# EAGLE design multitix-R1 (EAGLE 4.16)
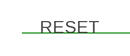
[diagram p0: schematic, sheet 1, part 1 of 2]
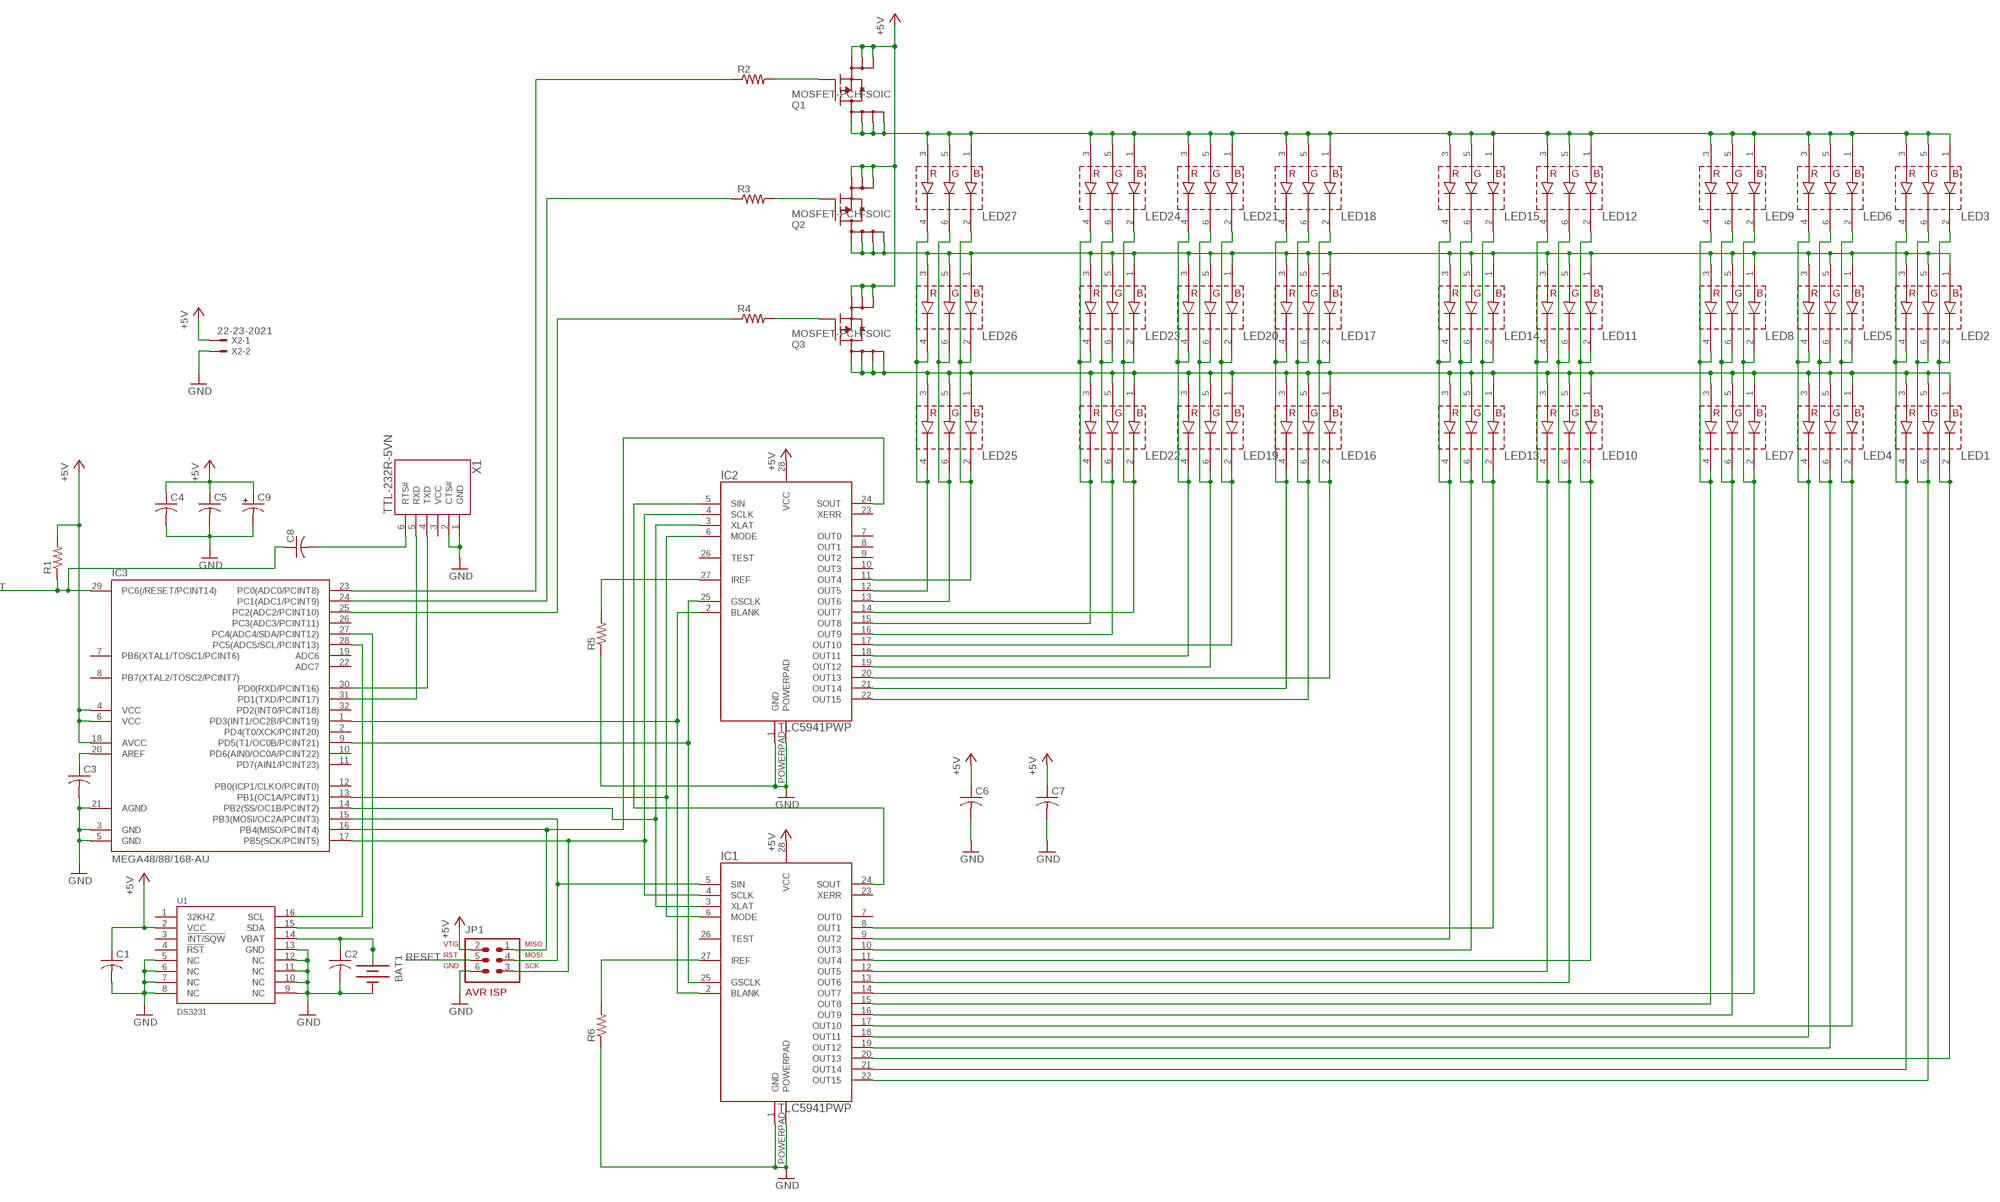
[diagram p1: schematic, sheet 1, part 2 of 2]

## Parts
BAT1  BATTERY12MM  [BATTCON_12MM]
C1  C-USC0805  [C0805]
C2  C-USC0805  [C0805]
C3  C-USC0805  [C0805]
C4  C-USC0805  [C0805]
C5  C-USC0805  [C0805]
C6  C-USC0805  [C0805]
C7  C-USC0805  [C0805]
C8  C-USC0805  [C0805]
C9  CPOL-USB  [PANASONIC_B]
IC1  TLC5941PWP  [POWERPAD-28]
IC2  TLC5941PWP  [POWERPAD-28]
IC3  MEGA48/88/168-AU  [TQFP32-08]
JP1  AVR-ISP-6  [AVR-ISP-6]
LED1  RGB-LED-PLCC6  [PLCC-6]
LED2  RGB-LED-PLCC6  [PLCC-6]
LED3  RGB-LED-PLCC6  [PLCC-6]
LED4  RGB-LED-PLCC6  [PLCC-6]
LED5  RGB-LED-PLCC6  [PLCC-6]
LED6  RGB-LED-PLCC6  [PLCC-6]
LED7  RGB-LED-PLCC6  [PLCC-6]
LED8  RGB-LED-PLCC6  [PLCC-6]
LED9  RGB-LED-PLCC6  [PLCC-6]
LED10  RGB-LED-PLCC6  [PLCC-6]
LED11  RGB-LED-PLCC6  [PLCC-6]
LED12  RGB-LED-PLCC6  [PLCC-6]
LED13  RGB-LED-PLCC6  [PLCC-6]
LED14  RGB-LED-PLCC6  [PLCC-6]
LED15  RGB-LED-PLCC6  [PLCC-6]
LED16  RGB-LED-PLCC6  [PLCC-6]
LED17  RGB-LED-PLCC6  [PLCC-6]
LED18  RGB-LED-PLCC6  [PLCC-6]
LED19  RGB-LED-PLCC6  [PLCC-6]
LED20  RGB-LED-PLCC6  [PLCC-6]
LED21  RGB-LED-PLCC6  [PLCC-6]
LED22  RGB-LED-PLCC6  [PLCC-6]
LED23  RGB-LED-PLCC6  [PLCC-6]
LED24  RGB-LED-PLCC6  [PLCC-6]
LED25  RGB-LED-PLCC6  [PLCC-6]
LED26  RGB-LED-PLCC6  [PLCC-6]
LED27  RGB-LED-PLCC6  [PLCC-6]
Q1  MOSFET-PCH-SOIC  [SOIC127P600X175-8AN]
Q2  MOSFET-PCH-SOIC  [SOIC127P600X175-8AN]
Q3  MOSFET-PCH-SOIC  [SOIC127P600X175-8AN]
R1  R-US_M0805  [M0805]
R2  R-US_M0805  [M0805]
R3  R-US_M0805  [M0805]
R4  R-US_M0805  [M0805]
R5  R-US_M0805  [M0805]
R6  R-US_M0805  [M0805]
U1  DS3231  [SO16W]
X1  TTL-232R-5VN  [USBCABLE-0.100-NOLBL]
X2  22-23-2021  [22-23-2021]

## Nets
+5V: C1.1 C4.1 C5.1 C6.1 C7.1 C9.+ IC1.28(VCC) IC2.28(VCC) IC3.4(VCC) IC3.6(VCC) IC3.18(AVCC) JP1.2 Q1.1(S) Q1.2(S1) Q1.3(S2) Q2.1(S) Q2.2(S1) Q2.3(S2) Q3.1(S) Q3.2(S1) Q3.3(S2) R1.2 U1.2(VCC) X2.1
GND: BAT1.GND(-) C1.2 C2.2 C3.2 C4.2 C5.2 C6.2 C7.2 C9.- IC1.1(GND) IC1.POWERPAD IC2.1(GND) IC2.POWERPAD IC3.3(GND) IC3.5(GND) IC3.21(AGND) JP1.6 R5.1 R6.1 U1.5(NC) U1.6(NC) U1.7(NC) U1.8(NC) U1.9(NC) U1.10(NC) U1.11(NC) U1.12(NC) U1.13(GND) X1.1(GND) X1.2(CTS#) X2.2
N$1: IC1.25(GSCLK) IC2.25(GSCLK) IC3.9(PD5(T1/OC0B/PCINT21))
N$2: IC2.21(OUT14) LED16.4(RK) LED17.4(RK) LED18.4(RK)
N$3: IC1.22(OUT15) LED1.6(GK) LED2.6(GK) LED3.6(GK)
N$4: IC1.20(OUT13) LED1.2(BK) LED2.2(BK) LED3.2(BK)
N$5: IC1.21(OUT14) LED1.4(RK) LED2.4(RK) LED3.4(RK)
N$6: IC1.2(BLANK) IC2.2(BLANK) IC3.1(PD3(INT1/OC2B/PCINT19))
N$7: LED3.1(BA) LED3.3(RA) LED3.5(GA) LED6.1(BA) LED6.3(RA) LED6.5(GA) LED9.1(BA) LED9.3(RA) LED9.5(GA) LED12.1(BA) LED12.3(RA) LED12.5(GA) LED15.1(BA) LED15.3(RA) LED15.5(GA) LED18.1(BA) LED18.3(RA) LED18.5(GA) LED21.1(BA) LED21.3(RA) LED21.5(GA) LED24.1(BA) LED24.3(RA) LED24.5(GA) LED27.1(BA) LED27.3(RA) LED27.5(GA) Q1.5(D) Q1.6(D1) Q1.7(D2) Q1.8(D3)
N$8: IC1.18(OUT11) LED4.4(RK) LED5.4(RK) LED6.4(RK)
N$9: IC1.19(OUT12) LED4.6(GK) LED5.6(GK) LED6.6(GK)
N$10: IC1.17(OUT10) LED4.2(BK) LED5.2(BK) LED6.2(BK)
N$11: IC2.22(OUT15) LED16.6(GK) LED17.6(GK) LED18.6(GK)
N$12: IC2.20(OUT13) LED16.2(BK) LED17.2(BK) LED18.2(BK)
N$13: LED2.1(BA) LED2.3(RA) LED2.5(GA) LED5.1(BA) LED5.3(RA) LED5.5(GA) LED8.1(BA) LED8.3(RA) LED8.5(GA) LED11.1(BA) LED11.3(RA) LED11.5(GA) LED14.1(BA) LED14.3(RA) LED14.5(GA) LED17.1(BA) LED17.3(RA) LED17.5(GA) LED20.1(BA) LED20.3(RA) LED20.5(GA) LED23.1(BA) LED23.3(RA) LED23.5(GA) LED26.1(BA) LED26.3(RA) LED26.5(GA) Q2.5(D) Q2.6(D1) Q2.7(D2) Q2.8(D3)
N$14: IC1.15(OUT8) LED7.4(RK) LED8.4(RK) LED9.4(RK)
N$15: IC1.16(OUT9) LED7.6(GK) LED8.6(GK) LED9.6(GK)
N$16: IC1.14(OUT7) LED7.2(BK) LED8.2(BK) LED9.2(BK)
N$17: IC1.6(MODE) IC2.6(MODE) IC3.13(PB1(OC1A/PCINT1))
N$18: IC2.18(OUT11) LED19.4(RK) LED20.4(RK) LED21.4(RK)
N$19: IC2.19(OUT12) LED19.6(GK) LED20.6(GK) LED21.6(GK)
N$20: IC1.12(OUT5) LED10.4(RK) LED11.4(RK) LED12.4(RK)
N$21: IC1.13(OUT6) LED10.6(GK) LED11.6(GK) LED12.6(GK)
N$22: IC1.11(OUT4) LED10.2(BK) LED11.2(BK) LED12.2(BK)
N$23: IC1.3(XLAT) IC2.3(XLAT) IC3.14(PB2(SS/OC1B/PCINT2))
N$24: IC1.4(SCLK) IC2.4(SCLK) IC3.17(PB5(SCK/PCINT5)) JP1.3
N$25: IC1.9(OUT2) LED13.4(RK) LED14.4(RK) LED15.4(RK)
N$26: IC1.10(OUT3) LED13.6(GK) LED14.6(GK) LED15.6(GK)
N$27: IC1.8(OUT1) LED13.2(BK) LED14.2(BK) LED15.2(BK)
N$28: IC2.17(OUT10) LED19.2(BK) LED20.2(BK) LED21.2(BK)
N$29: IC2.15(OUT8) LED22.4(RK) LED23.4(RK) LED24.4(RK)
N$30: IC2.16(OUT9) LED22.6(GK) LED23.6(GK) LED24.6(GK)
N$31: IC1.24(SOUT) IC2.5(SIN)
N$32: IC2.14(OUT7) LED22.2(BK) LED23.2(BK) LED24.2(BK)
N$33: IC3.30(PD0(RXD/PCINT16)) X1.4(TXD)
N$34: BAT1.PWR@1(+) C2.1 U1.14(VBAT)
N$35: IC1.5(SIN) IC3.15(PB3(MOSI/OC2A/PCINT3)) JP1.4
N$36: IC2.12(OUT5) LED25.4(RK) LED26.4(RK) LED27.4(RK)
N$37: IC2.13(OUT6) LED25.6(GK) LED26.6(GK) LED27.6(GK)
N$38: IC2.11(OUT4) LED25.2(BK) LED26.2(BK) LED27.2(BK)
N$39: LED1.1(BA) LED1.3(RA) LED1.5(GA) LED4.1(BA) LED4.3(RA) LED4.5(GA) LED7.1(BA) LED7.3(RA) LED7.5(GA) LED10.1(BA) LED10.3(RA) LED10.5(GA) LED13.1(BA) LED13.3(RA) LED13.5(GA) LED16.1(BA) LED16.3(RA) LED16.5(GA) LED19.1(BA) LED19.3(RA) LED19.5(GA) LED22.1(BA) LED22.3(RA) LED22.5(GA) LED25.1(BA) LED25.3(RA) LED25.5(GA) Q3.5(D) Q3.6(D1) Q3.7(D2) Q3.8(D3)
N$40: IC2.24(SOUT) IC3.16(PB4(MISO/PCINT4)) JP1.1
N$41: IC3.28(PC5(ADC5/SCL/PCINT13)) U1.16(SCL)
N$42: IC3.27(PC4(ADC4/SDA/PCINT12)) U1.15(SDA)
N$43: C3.1 IC3.20(AREF)
N$44: IC3.31(PD1(TXD/PCINT17)) X1.5(RXD)
N$45: Q3.4(G) R4.2
N$46: Q2.4(G) R3.2
N$47: Q1.4(G) R2.2
N$48: IC1.27(IREF) R6.2
N$49: IC2.27(IREF) R5.2
N$50: C8.2 X1.6(RTS#)
N$51: IC3.23(PC0(ADC0/PCINT8)) R2.1
N$52: IC3.24(PC1(ADC1/PCINT9)) R3.1
N$53: IC3.25(PC2(ADC2/PCINT10)) R4.1
RESET: C8.1 IC3.29(PC6(/RESET/PCINT14)) JP1.5 R1.1
Unconnected: IC1.7(OUT0) IC1.23(XERR) IC1.26(TEST) IC2.7(OUT0) IC2.8(OUT1) IC2.9(OUT2) IC2.10(OUT3) IC2.23(XERR) IC2.26(TEST) IC3.2(PD4(T0/XCK/PCINT20)) IC3.7(PB6(XTAL1/TOSC1/PCINT6)) IC3.8(PB7(XTAL2/TOSC2/PCINT7)) IC3.10(PD6(AIN0/OC0A/PCINT22)) IC3.11(PD7(AIN1/PCINT23)) IC3.12(PB0(ICP1/CLKO/PCINT0)) IC3.19(ADC6) IC3.22(ADC7) IC3.26(PC3(ADC3/PCINT11)) IC3.32(PD2(INT0/PCINT18)) U1.1(32KHZ) U1.3(!INT/SQW) U1.4(!RST) X1.3(VCC)

## Library data of the parts
BAT1 = sfe-sparkfun:BATTERY: Battery Holders Various common sizes : AA, AAA, 20mm coin cell and 12mm coin cell.
C1-C8 = rcl:C-US: CAPACITOR, American symbol
C9 = rcl:CPOL-US: POLARIZED CAPACITOR, American symbol
IC1 IC2 = rbg-ti-ledcontrol:TLC5941
IC3 = avr-5-4.16:MEGA48/88/168
JP1 = avr-5-4.16:AVR-ISP-6: AVR ISP-6 Serial Programming Header
LED1-LED27 = rbg-topbright-rgb-smd-led:RGB-LED-PLCC6
Q1-Q3 = ipc-7351-transistor:MOSFET-PCH-SOIC
R1-R6 = rcl:R-US_: RESISTOR, American symbol
U1 = DS3231:DS3231
X1 = rbg-ftdi-usb:TTL-232R-5V
X2 = con-molex:22-23-2021: .100" (2.54mm) Center Header - 2 Pin

## Board
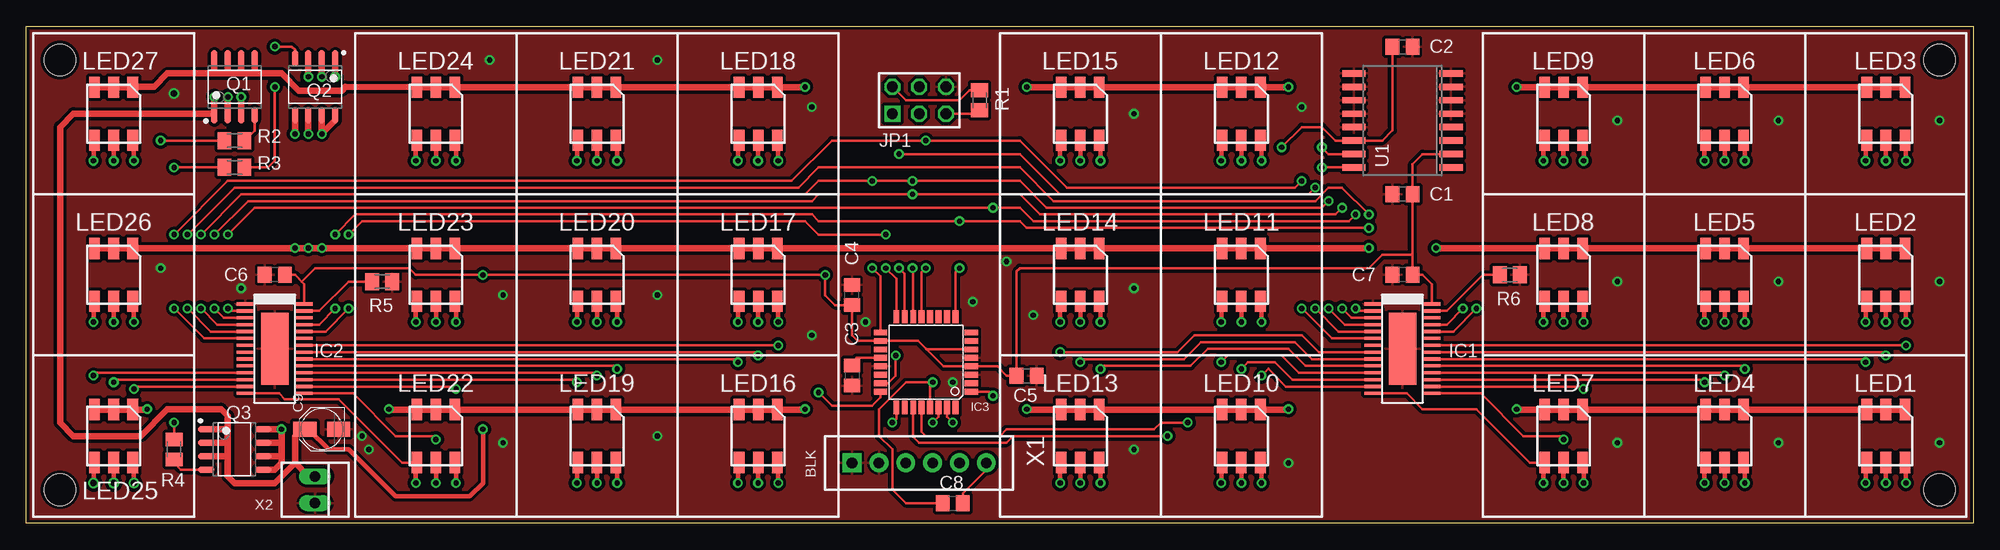
[diagram p2: board, top side]
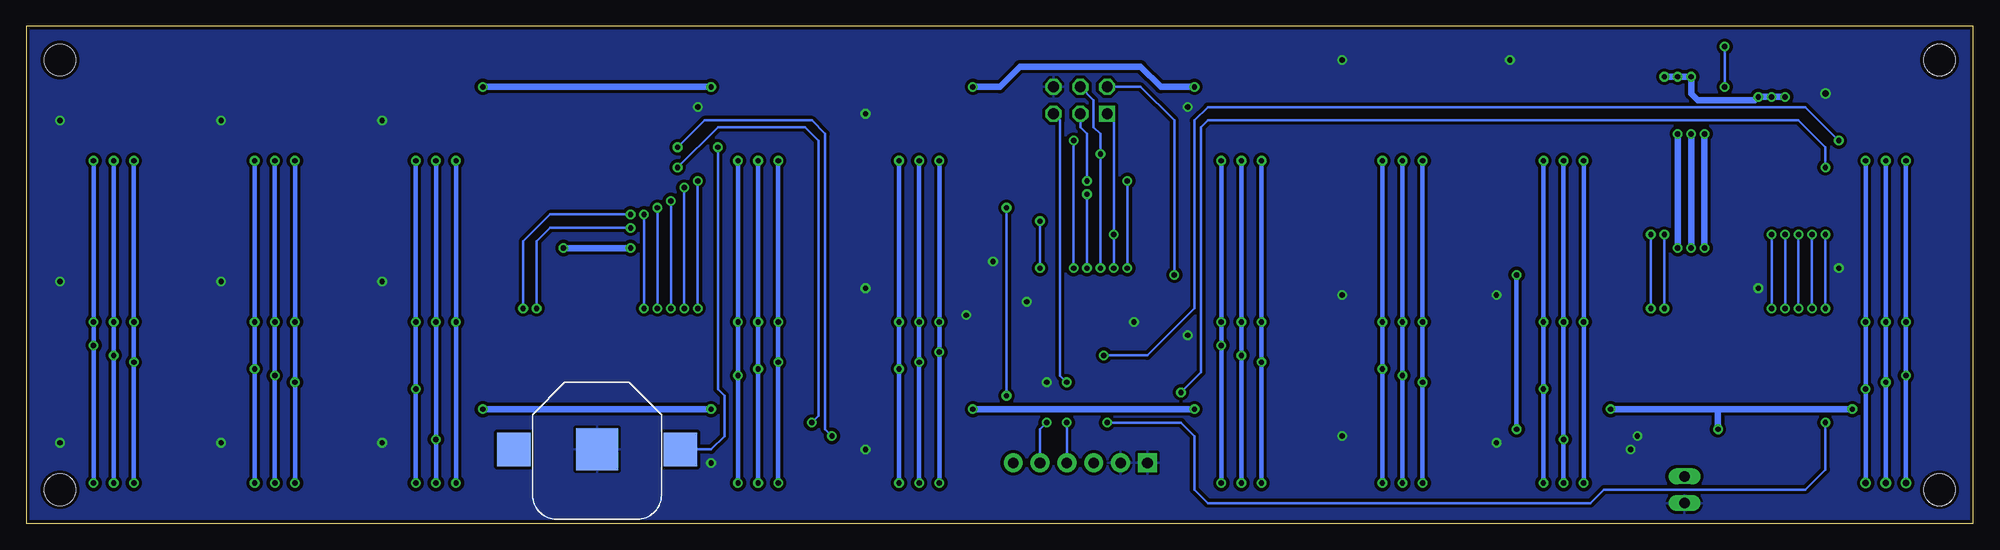
[diagram p3: board, bottom side, seen from below]

Size 184.15 x 46.99 mm. Coordinates in mm from the lower left corner, seen from the top.
Outline: 0,0 0,46.99 184.15,46.99 184.15,0 0,0
Copper layers (1*16): Top 0.035mm / dielectric 1.5mm / Bottom 0.035mm
Design rules "default": minimum track width 10mil, minimum drill 19mil, track to track 8mil, track to pad 8mil, pad to pad 8mil, via to via 8mil, smd to smd 8mil, copper to edge 10mil, drill to drill 8mil, minimum pad ring 10mil, minimum via ring 8mil, stop-mask expansion 4mil, vias tented up to drill 20mil, thermal gap 10mil
Holes 3 mm at 3.17,3.17 3.17,43.81 180.97,43.81 180.97,3.17

### Footprints (pad centres in the part's own frame; a part is rotated, then mirrored left to right if it is on the bottom)
BATTCON_12MM = smd 3.962 x 3.962: GND 0,0 | smd 3.175 x 3.175: PWR@1 -7.874,0; PWR@2 7.874,0
C0805 = smd 1.3 x 1.5: 1 -0.95,0; 2 0.95,0
PANASONIC_B = smd 2.2 x 1.4: + 1.6,0; - -1.6,0
POWERPAD-28 = smd 0.3 x 1.6: 1 -4.225,-2.8; 2 -3.575,-2.8; 3 -2.925,-2.8; 4 -2.275,-2.8; 5 -1.625,-2.8; 6 -0.975,-2.8; 7 -0.325,-2.8; 8 0.325,-2.8; 9 0.975,-2.8; 10 1.625,-2.8; 11 2.275,-2.8; 12 2.925,-2.8; 13 3.575,-2.8; 14 4.225,-2.8; 15 4.225,2.8; 16 3.575,2.8; 17 2.925,2.8; 18 2.275,2.8; 19 1.625,2.8; 20 0.975,2.8; 21 0.325,2.8; 22 -0.325,2.8; 23 -0.975,2.8; 24 -1.625,2.8; 25 -2.275,2.8; 26 -2.925,2.8; 27 -3.575,2.8; 28 -4.225,2.8 | smd 6.8 x 2.6: POWERPAD 0,0
TQFP32-08 = smd 1.27 x 0.559: 1 -4.293,2.8; 2 -4.293,2; 3 -4.293,1.2; 4 -4.293,0.4; 5 -4.293,-0.4; 6 -4.293,-1.2; 7 -4.293,-2; 8 -4.293,-2.8; 17 4.293,-2.8; 18 4.293,-2; 19 4.293,-1.2; 20 4.293,-0.4; 21 4.293,0.4; 22 4.293,1.2; 23 4.293,2; 24 4.293,2.8 | smd 0.559 x 1.27: 9 -2.8,-4.293; 10 -2,-4.293; 11 -1.2,-4.293; 12 -0.4,-4.293; 13 0.4,-4.293; 14 1.2,-4.293; 15 2,-4.293; 16 2.8,-4.293; 25 2.8,4.293; 26 2,4.293; 27 1.2,4.293; 28 0.4,4.293; 29 -0.4,4.293; 30 -1.2,4.293; 31 -2,4.293; 32 -2.8,4.293
AVR-ISP-6 = drill 1.016 square: 1 -2.54,-1.27 | drill 1.016 octagon: 2 -2.54,1.27; 3 0,-1.27; 4 0,1.27; 5 2.54,-1.27; 6 2.54,1.27
PLCC-6 = smd 1 x 2: 1 -1.8,2.5; 2 -1.8,-2.5; 3 0,2.5; 4 0,-2.5; 5 1.8,2.5; 6 1.8,-2.5
SOIC127P600X175-8AN = smd 1.55 x 0.6: 1 -2.7,1.905; 2 -2.7,0.635; 3 -2.7,-0.635; 4 -2.7,-1.905; 5 2.7,-1.905; 6 2.7,-0.635; 7 2.7,0.635; 8 2.7,1.905
M0805 = smd 1.3 x 1.6: 1 -0.95,0; 2 0.95,0
SO16W = smd 0.6 x 2.2: 1 -4.445,-4.6; 2 -3.175,-4.6; 3 -1.905,-4.6; 4 -0.635,-4.6; 5 0.635,-4.6; 6 1.905,-4.6; 7 3.175,-4.6; 8 4.445,-4.6; 9 4.445,4.6; 10 3.175,4.6; 11 1.905,4.6; 12 0.635,4.6; 13 -0.635,4.6; 14 -1.905,4.6; 15 -3.175,4.6; 16 -4.445,4.6
USBCABLE-0.100-NOLBL = drill 1 pad 1.778 square: 1 0,-7.62 | drill 1 pad 1.778 round: 2 0,-5.08; 3 0,-2.54; 4 0,0; 5 0,2.54; 6 0,5.08
22-23-2021 = drill 1 long: 1 -1.27,0; 2 1.27,0

### Placement (x,y rotation side)
BAT1  130.17,6.98 180 bottom
C1  130.17,31.12 180 top
C2  130.17,45.09 0 top
C3  78.11,13.97 270 top
C4  78.11,21.59 90 top
C5  94.62,13.97 0 top
C6  23.5,23.5 180 top
C7  130.17,23.5 180 top
C8  87.63,1.91 0 top
C9  27.94,8.89 180 top
IC1  130.17,16.51 270 top
IC2  23.5,16.51 270 top
IC3  85.09,15.24 180 top
JP1  84.45,40 0 top
LED1  175.89,8.26 0 top
LED2  175.89,23.5 0 top
LED3  175.89,38.73 0 top
LED4  160.66,8.26 0 top
LED5  160.66,23.5 0 top
LED6  160.66,38.73 0 top
LED7  145.41,8.26 0 top
LED8  145.41,23.5 0 top
LED9  145.41,38.73 0 top
LED10  114.94,8.26 0 top
LED11  114.94,23.5 0 top
LED12  114.94,38.73 0 top
LED13  99.7,8.26 0 top
LED14  99.7,23.5 0 top
LED15  99.7,38.73 0 top
LED16  69.22,8.26 0 top
LED17  69.22,23.5 0 top
LED18  69.22,38.73 0 top
LED19  53.98,8.26 0 top
LED20  53.98,23.5 0 top
LED21  53.98,38.73 0 top
LED22  38.73,8.26 0 top
LED23  38.73,23.5 0 top
LED24  38.73,38.73 0 top
LED25  8.26,8.26 0 top
LED26  8.26,23.5 0 top
LED27  8.26,38.73 0 top
Q1  19.69,41.27 90 top
Q2  27.31,41.27 270 top
Q3  19.69,6.98 0 top
R1  90.17,40 90 top
R2  19.69,36.2 0 top
R3  19.69,33.66 0 top
R4  13.97,6.98 270 top
R5  33.66,22.86 180 top
R6  140.33,23.5 180 top
U1  130.17,38.1 90 top
X1  85.73,5.71 270 top
X2  27.31,3.17 270 top

### Tracks (layer width: path | path; a pad name or v marks a point on that pad's centre or on a via)
+5V  (via drill 0.5)
  Top 0.254: 85.09,16.51 86.76,14.84 IC3.4 91.84,14.84 92.71,13.97 C5.1 93.67,23.82 93.98,24.13 127,24.13 128.27,25.4 131.12,25.4 | 85.09,16.51 84.36,17.24 IC3.18 78.65,17.24 78.11,17.78 C4.1 76.52,20.64 75.57,21.59 v75.57,23.5 v43.18,23.5 36.83,23.5 36.2,24.13 27.31,24.13 26.04,22.86 | IC3.6 85.16,16.44 85.09,16.51 | U1.2 132.08,34.92 131.12,33.97 C1.1 131.12,25.4 | IC1.28 132.97,22.6 132.08,23.5 C7.1 130.81,23.5 131.12,23.81 131.12,25.4 | 26.04,22.86 26.3,22.6 | 26.04,22.86 25.4,23.5 | 26.3,22.6 IC2.28 | 26.3,22.6 25.4,23.5 | 25.4,23.5 C6.1 | JP1.2 83.19,40 88.27,40 89.22,40.95 R1.2
  Top 0.406: v43.18,8.89 43.18,3.81 41.91,2.54 34.92,2.54 30.48,6.98 28.58,6.98 26.67,8.89 C9.+
  Top 0.61: 17.78,38.73 v17.78,40.32 | v29.21,42.23 Q2.1 | v27.94,42.23 Q2.2 | v26.67,42.23 Q2.3 | v20.32,40.32 Q1.3 | v19.05,40.32 Q1.2 | 19.05,6.35 Q3.3 | 19.05,8.89 19.05,10.16 18.42,10.79 13.33,10.79 10.79,8.26 4.45,8.26 3.17,9.53 3.17,37.46 4.45,38.73 17.78,38.73 | 19.05,8.89 19.05,7.62 | 19.05,7.62 19.05,6.35 | 17.78,38.73 Q1.1 | 19.05,7.62 Q3.2 | 19.05,8.89 Q3.1 | 19.05,6.35 19.05,4.45 19.69,3.81 23.5,3.81 25.4,5.71 | C9.+ 26.04,8.89 25.4,8.26 25.4,5.71 | X2.1 26.67,4.45 25.4,5.71
  Bottom 0.254: v75.57,23.5 75.57,38.1 78.74,41.27 JP1.2
  Bottom 0.406: v43.18,8.89 v43.18,23.5
  Bottom 0.61: v17.78,40.32 v19.05,40.32 v20.32,40.32 20.64,40 26.04,40 26.67,40.64 v26.67,42.23 v27.94,42.23 v29.21,42.23
GND  (via drill 0.5, 0.6)
  other vias: 32.38,6.98 31.75,8.26 20.32,22.23 13.97,40.64 12.7,24.13 45.09,21.59 43.81,43.81 59.69,43.81 59.69,21.59 59.69,8.26 45.09,7.62 74.3,39.37 74.3,17.78 104.78,38.73 120.65,39.37 104.78,22.23 104.78,6.98 119.38,5.71 150.5,7.62 150.5,22.86 150.5,38.1 165.73,38.1 165.73,22.86 165.73,7.62 180.97,7.62 180.97,22.86 180.97,38.1 89.54,20.96 87.63,13.33 79.38,19.05 92.71,24.77 95.25,19.69
  pour Top (isolate 0.305): -1.27,48.26 185.42,48.26 185.42,-1.27 -1.27,-1.27
  pour Bottom (isolate 0.305): -1.27,48.26 185.42,48.26 185.42,-1.27 -1.27,-1.27
N$1  (via drill 0.5)
  Top 0.254: IC2.25 27.68,18.79 v29.21,20.32 | v29.21,27.31 31.12,29.21 74.3,29.21 74.93,28.58 v88.27,28.58 93.98,28.58 94.62,27.94 v127,27.94 | IC1.25 134.35,18.79 v135.89,20.32 | IC3.9 87.89,23.76 v88.27,24.13
  Bottom 0.254: v29.21,20.32 v29.21,27.31 | v127,27.94 134.62,27.94 135.89,26.67 v135.89,20.32 | v88.27,28.58 v88.27,24.13
N$2  (via drill 0.5)
  Top 0.254: IC2.21 68.91,16.19 v69.22,15.88
  Top 0.406: v69.22,34.29 LED18.4 | v69.22,19.05 LED17.4 | v69.22,3.81 LED16.4
  Bottom 0.406: v69.22,34.29 v69.22,19.05 v69.22,15.88 v69.22,3.81
N$3  (via drill 0.5)
  Top 0.254: IC1.22 177.16,16.84 v177.8,16.83
  Top 0.406: LED3.6 177.8,36.23 v177.8,34.29 | LED2.6 177.8,21 v177.8,19.05 | LED1.6 177.8,5.75 v177.8,3.81
  Bottom 0.406: v177.8,34.29 v177.8,19.05 v177.8,16.83 v177.8,3.81
N$4  (via drill 0.5)
  Top 0.254: IC1.20 173.69,15.54 v173.99,15.24
  Top 0.406: LED3.2 173.99,36.23 v173.99,34.29 | LED2.2 173.99,21 v173.99,19.05 | LED1.2 173.99,5.75 v173.99,3.81
  Bottom 0.406: v173.99,34.29 v173.99,19.05 v173.99,15.24 v173.99,3.81
N$5  (via drill 0.5)
  Top 0.254: IC1.21 175.58,16.19 v175.89,15.88
  Top 0.406: v175.89,34.29 LED3.4 | v175.89,19.05 LED2.4 | v175.89,3.81 LED1.4
  Bottom 0.406: v175.89,34.29 v175.89,19.05 v175.89,15.88 v175.89,3.81
N$6  (via drill 0.5)
  Top 0.254: IC2.2 19.29,20.09 v19.05,20.32 | v19.05,27.31 21.59,29.85 v91.44,29.85 93.98,29.85 95.25,28.58 125.09,28.58 v125.73,29.21 | IC1.2 125.97,20.09 v125.73,20.32 | IC3.1 91.07,12.44 v91.44,12.06
  Bottom 0.254: v19.05,20.32 v19.05,27.31 | v125.73,29.21 v125.73,20.32 | v91.44,29.85 v91.44,12.06
N$7  (via drill 0.5)
  Top 0.61: LED3.3 LED3.5 | LED3.3 175.89,41.27 | LED3.1 173.99,41.23 173.99,41.27 | LED3.1 LED3.3 | 162.56,41.23 LED6.5 LED6.3 | 162.56,41.23 LED3.1 | 162.56,41.23 162.56,41.27 | LED6.3 160.66,41.27 | LED6.1 158.75,41.23 158.75,41.27 | LED6.1 LED6.3 | 147.32,41.23 LED9.5 LED9.3 | 147.32,41.23 LED6.1 | 147.32,41.23 147.32,41.27 | LED9.3 145.41,41.27 | LED9.1 143.51,41.23 143.51,41.27 | LED9.1 LED9.3 | 116.84,41.23 LED12.5 LED12.3 | 116.84,41.23 116.84,41.27 | LED12.3 114.94,41.27 | LED12.1 113.03,41.23 113.03,41.27 | LED12.1 LED12.3 | 101.6,41.23 LED15.5 LED15.3 | 101.6,41.23 LED12.1 | 101.6,41.23 101.6,41.27 | LED15.3 99.7,41.27 | LED15.1 97.79,41.23 97.79,41.27 | LED15.1 LED15.3 | 71.12,41.23 LED18.5 LED18.3 | 71.12,41.23 71.12,41.27 | LED18.3 69.22,41.27 | LED18.1 67.31,41.23 67.31,41.27 | LED18.1 LED18.3 | 55.88,41.23 LED21.5 LED21.3 | 55.88,41.23 LED18.1 | 55.88,41.23 55.88,41.27 | LED21.3 53.98,41.27 | LED21.1 52.07,41.23 52.07,41.27 | LED21.1 LED21.3 | 40.64,41.23 LED24.5 LED24.3 | 40.64,41.23 LED21.1 | 40.64,41.23 40.64,41.27 | LED24.3 38.73,41.27 | LED24.1 36.83,41.23 36.83,41.27 | LED24.1 LED24.3 | LED27.5 10.16,41.23 10.16,41.27 | LED27.3 LED27.5 | LED27.3 8.26,41.27 | LED27.1 6.35,41.23 | 6.35,41.23 LED27.3 | 6.35,41.23 6.35,41.27 | 71.12,41.23 73.62,41.23 v73.66,41.27 | LED15.1 94.66,41.23 v94.62,41.27 | 116.84,41.23 119.34,41.23 v119.38,41.27 | LED9.1 141.01,41.23 v140.97,41.27 | LED24.1 30.16,41.27 29.81,40.92 25.76,40.92 24.13,42.54 21.59,42.54 | 17.78,42.54 13.33,42.54 12.06,41.27 10.16,41.27 | 17.78,42.54 19.05,42.54 | 19.05,42.54 20.32,42.54 | 20.32,42.54 21.59,42.54 | 10.16,41.27 10.12,41.23 LED27.5 | 17.78,42.54 Q1.8 | 19.05,42.54 Q1.7 | 20.32,42.54 Q1.6
  Top 0.61: 21.59,42.54 Q1.5
  Bottom 0.61: v73.66,41.27 76.84,41.27 78.74,43.18 90.17,43.18 92.08,41.27 v94.62,41.27 | v119.38,41.27 v140.97,41.27
N$8  (via drill 0.5)
  Top 0.254: IC1.18 160.39,14.23 v160.66,13.97
  Top 0.406: v160.66,34.29 LED6.4 | v160.66,19.05 LED5.4 | v160.66,3.81 LED4.4
  Bottom 0.406: v160.66,34.29 v160.66,19.05 v160.66,13.97 v160.66,3.81
N$9  (via drill 0.5)
  Top 0.254: IC1.19 162.28,14.88 v162.56,14.61
  Top 0.406: LED6.6 162.56,36.23 v162.56,34.29 | LED5.6 162.56,21 v162.56,19.05 | LED4.6 162.56,5.75 v162.56,3.81
  Bottom 0.406: v162.56,34.29 v162.56,19.05 v162.56,14.61 v162.56,3.81
N$10  (via drill 0.5)
  Top 0.254: IC1.17 158.5,13.58 v158.75,13.33
  Top 0.406: LED6.2 158.75,36.23 v158.75,34.29 | LED5.2 158.75,21 v158.75,19.05 | LED4.2 158.75,5.75 v158.75,3.81
  Bottom 0.406: v158.75,34.29 v158.75,19.05 v158.75,13.33 v158.75,3.81
N$11  (via drill 0.5)
  Top 0.254: IC2.22 v71.11,16.84 v71.12,16.83
  Top 0.406: LED18.6 71.12,36.23 v71.12,34.29 | LED17.6 71.12,21 v71.12,19.05 | LED16.6 71.12,5.75 v71.12,3.81
  Bottom 0.406: v71.12,34.29 v71.12,19.05 v71.12,16.83 v71.12,3.81
N$12  (via drill 0.5)
  Top 0.254: IC2.20 67.02,15.54 v67.31,15.24
  Top 0.406: LED18.2 67.31,36.23 v67.31,34.29 | LED17.2 67.31,21 v67.31,19.05 | LED16.2 67.31,5.75 v67.31,3.81
  Bottom 0.406: v67.31,34.29 v67.31,19.05 v67.31,15.24 v67.31,3.81
N$13  (via drill 0.5)
  Top 0.61: LED2.3 LED2.5 | LED2.3 175.89,26.04 | LED2.1 173.99,26 173.99,26.04 | LED2.1 LED2.3 | 162.56,26 LED5.5 LED5.3 | 162.56,26 LED2.1 | 162.56,26 162.56,26.04 | LED5.3 160.66,26.04 | LED5.1 158.75,26 158.75,26.04 | LED5.1 LED5.3 | 147.32,26 LED8.5 LED8.3 | 147.32,26 LED5.1 | 147.32,26 147.32,26.04 | LED8.3 145.41,26.04 | LED8.1 143.51,26 143.51,26.04 | LED8.1 LED8.3 | 116.84,26 LED11.5 LED11.3 | 116.84,26 116.84,26.04 | LED11.3 114.94,26.04 | LED11.1 113.03,26 113.03,26.04 | LED11.1 LED11.3 | 101.6,26 LED14.5 LED14.3 | 101.6,26 LED11.1 | 101.6,26 101.6,26.04 | LED14.3 99.7,26.04 | LED14.1 97.79,26 97.79,26.04 | LED14.1 LED14.3 | 71.12,26 LED17.5 LED17.3 | 71.12,26 LED14.1 | 71.12,26 71.12,26.04 | LED17.3 69.22,26.04 | LED17.1 67.31,26 67.31,26.04 | LED17.1 LED17.3 | 55.88,26 LED20.5 LED20.3 | 55.88,26 LED17.1 | 55.88,26 55.88,26.04 | LED20.3 53.98,26.04 | LED20.1 52.07,26 52.07,26.04 | LED20.1 LED20.3 | 40.64,26 LED23.5 LED23.3 | 40.64,26 LED20.1 | 40.64,26 40.64,26.04 | LED23.3 38.73,26.04 | LED23.1 36.83,26 36.83,26.04 | LED23.1 LED23.3 | LED26.5 10.16,26 10.16,26.04 | LED26.3 LED26.5 | LED26.3 8.26,26.04 | LED26.1 6.35,26 | 6.35,26 LED26.3 | 6.35,26 6.35,26.04 | v25.4,36.83 Q2.5 | v26.67,36.83 Q2.6 | Q2.7 v27.94,36.83 29.21,38.1 Q2.8 | LED23.1 27.98,26 v27.94,26.04 v25.4,26.04 | v25.4,26.04 v26.67,26.04 | 10.16,26.04 10.12,26 LED26.5 | 10.16,26.04 v25.4,26.04 | 116.84,26 126.96,26 v127,26.04 | LED8.1 133.39,26 v133.35,26.04
  Bottom 0.61: v25.4,26.04 v25.4,36.83 | v26.67,26.04 v26.67,36.83 | v27.94,26.04 v27.94,36.83 | v127,26.04 v133.35,26.04
N$14  (via drill 0.5)
  Top 0.254: IC1.15 137.57,12.29 141.6,8.26 145.1,8.26 v145.41,7.94
  Top 0.406: v145.41,34.29 LED9.4 | v145.41,19.05 LED8.4 | v145.41,3.81 LED7.4
  Bottom 0.406: v145.41,34.29 v145.41,19.05 v145.41,7.94 v145.41,3.81
N$15  (via drill 0.5)
  Top 0.254: IC1.16 147.08,12.94 v147.32,12.7
  Top 0.406: LED9.6 147.32,36.23 v147.32,34.29 | LED8.6 147.32,21 v147.32,19.05 | LED7.6 147.32,5.75 v147.32,3.81
  Bottom 0.406: v147.32,34.29 v147.32,19.05 v147.32,12.7 v147.32,3.81
N$16  (via drill 0.5)
  Top 0.254: IC1.14 130.59,12.29 132.08,10.79 137.16,10.79 142.24,5.71 143.51,5.71 143.55,5.75 LED7.2
  Top 0.406: LED9.2 143.51,36.23 v143.51,34.29 | LED8.2 143.51,21 v143.51,19.05 | LED7.2 143.51,5.75 143.51,5.71 v143.51,3.81
  Bottom 0.406: v143.51,34.29 v143.51,19.05 v143.51,3.81
N$17  (via drill 0.5)
  Top 0.254: IC2.6 16.81,17.49 v13.97,20.32 | v13.97,27.31 19.05,32.38 72.39,32.38 76.2,36.2 v85.09,36.2 93.98,36.2 98.43,31.75 120.02,31.75 v120.65,32.38 | IC1.6 123.48,17.49 v120.65,20.32 | IC3.13 84.69,23.73 v85.09,24.13
  Bottom 0.254: v13.97,20.32 v13.97,27.31 | v120.65,32.38 v120.65,20.32 | v85.09,36.2 v85.09,24.13
N$18  (via drill 0.5)
  Top 0.254: IC2.18 53.71,14.23 v53.98,13.97
  Top 0.406: v53.98,34.29 LED21.4 | v53.98,19.05 LED20.4 | v53.98,3.81 LED19.4
  Bottom 0.406: v53.98,34.29 v53.98,19.05 v53.98,13.97 v53.98,3.81
N$19  (via drill 0.5)
  Top 0.254: IC2.19 55.6,14.88 v55.88,14.61
  Top 0.406: LED21.6 55.88,36.23 v55.88,34.29 | LED20.6 55.88,21 v55.88,19.05 | LED19.6 55.88,5.75 v55.88,3.81
  Bottom 0.406: v55.88,34.29 v55.88,19.05 v55.88,14.61 v55.88,3.81
N$20  (via drill 0.5)
  Top 0.254: IC1.12 119.77,13.58 118.11,15.24 115.57,15.24 v114.94,14.61
  Top 0.406: v114.94,34.29 LED12.4 | v114.94,19.05 LED11.4 | v114.94,3.81 LED10.4
  Bottom 0.406: v114.94,34.29 v114.94,19.05 v114.94,14.61 v114.94,3.81
N$21  (via drill 0.5)
  Top 0.254: IC1.13 119.15,12.94 117.48,14.61 v116.84,13.97
  Top 0.406: LED12.6 116.84,36.23 v116.84,34.29 | LED11.6 116.84,21 v116.84,19.05 | LED10.6 116.84,5.75 v116.84,3.81
  Bottom 0.406: v116.84,34.29 v116.84,19.05 v116.84,13.97 v116.84,3.81
N$22  (via drill 0.5)
  Top 0.254: IC1.11 120.39,14.23 118.75,15.88 113.67,15.88 v113.03,15.24
  Top 0.406: LED12.2 113.03,36.23 v113.03,34.29 | LED11.2 113.03,21 v113.03,19.05 | LED10.2 113.03,5.75 v113.03,3.81
  Bottom 0.406: v113.03,34.29 v113.03,19.05 v113.03,15.24 v113.03,3.81
N$23  (via drill 0.5)
  Top 0.254: IC1.3 125.34,19.44 v124.46,20.32 | v17.78,27.31 20.96,30.48 74.3,30.48 74.93,31.12 v83.82,31.12 93.98,31.12 95.89,29.21 123.83,29.21 v124.46,29.85 | IC2.3 18.67,19.44 v17.78,20.32 | IC3.14 83.89,24.06 v83.82,24.13
  Bottom 0.254: v124.46,29.85 v124.46,20.32 | v17.78,20.32 v17.78,27.31 | v83.82,31.12 v83.82,24.13
N$24  (via drill 0.5)
  Top 0.254: IC1.4 124.73,18.79 v123.19,20.32 | v16.51,27.31 20.32,31.12 73.66,31.12 74.93,32.38 v80.01,32.38 v83.82,32.38 93.98,32.38 96.52,29.85 122.56,29.85 v123.19,30.48 | IC2.4 18.05,18.79 v16.51,20.32 | IC3.17 80.8,23.34 v80.01,24.13
  Bottom 0.254: v123.19,30.48 v123.19,20.32 | v16.51,20.32 v16.51,27.31 | v80.01,32.38 v80.01,24.13 | JP1.3 84.45,37.46 83.82,36.83 v83.82,32.38
N$25  (via drill 0.5)
  Top 0.254: IC1.9 121.62,15.54 120.02,17.15 111.12,17.15 109.52,15.54 99.99,15.54 v99.7,15.24
  Top 0.406: v99.7,34.29 LED15.4 | v99.7,19.05 LED14.4 | v99.7,3.81 LED13.4
  Bottom 0.406: v99.7,34.29 v99.7,19.05 v99.7,15.24 v99.7,3.81
N$26  (via drill 0.5)
  Top 0.254: IC1.10 121.01,14.88 119.38,16.51 111.76,16.51 110.14,14.88 101.88,14.88 v101.6,14.61
  Top 0.406: LED15.6 101.6,36.23 v101.6,34.29 | LED13.6 101.6,5.75 v101.6,3.81 | LED14.6 101.6,21 v101.6,19.05
  Bottom 0.406: v101.6,3.81 v101.6,14.61 v101.6,19.05 v101.6,34.29
N$27  (via drill 0.5)
  Top 0.254: IC1.8 122.25,16.19 120.65,17.78 110.49,17.78 108.9,16.19 v97.8,16.19 v97.79,16.19
  Top 0.406: LED15.2 97.79,36.23 v97.79,34.29 | LED14.2 97.79,21 v97.79,19.05 | LED13.2 97.79,5.75 v97.79,3.81
  Bottom 0.406: v97.79,34.29 v97.79,19.05 v97.79,16.19 v97.79,3.81
N$28  (via drill 0.5)
  Top 0.254: IC2.17 51.82,13.58 v52.07,13.33
  Top 0.406: LED21.2 52.07,36.23 v52.07,34.29 | LED20.2 52.07,21 v52.07,19.05 | LED19.2 52.07,5.75 v52.07,3.81
  Bottom 0.406: v52.07,34.29 v52.07,19.05 v52.07,13.33 v52.07,3.81
N$29  (via drill 0.5)
  Top 0.254: IC2.15 30.9,12.29 34.92,8.26 38.42,8.26 v38.73,7.94
  Top 0.406: v38.73,34.29 LED24.4 | v38.73,19.05 LED23.4 | v38.73,3.81 LED22.4
  Bottom 0.406: v38.73,34.29 v38.73,19.05 v38.73,7.94 v38.73,3.81
N$30  (via drill 0.5)
  Top 0.254: IC2.16 40.41,12.94 v40.64,12.7
  Top 0.406: LED24.6 40.64,36.23 v40.64,34.29 | LED23.6 40.64,21 v40.64,19.05 | LED22.6 40.64,5.75 v40.64,3.81
  Bottom 0.406: v40.64,34.29 v40.64,19.05 v40.64,12.7 v40.64,3.81
N$31  (via drill 0.5)
  Top 0.254: IC2.5 17.43,18.14 v15.24,20.32 | IC1.24 134.97,18.14 v137.16,20.32 | v15.24,27.31 19.69,31.75 73.03,31.75 74.93,33.66 93.98,33.66 97.16,30.48 121.92,30.48 123.19,31.75 124.46,31.75 v127,29.21
  Bottom 0.254: v15.24,20.32 v15.24,27.31 | v127,29.21 134.62,29.21 137.16,26.67 v137.16,20.32
N$32  (via drill 0.5)
  Top 0.254: IC2.14 23.91,12.29 24.45,11.75 29.53,11.75 35.56,5.71 36.83,5.71 36.87,5.75 LED22.2
  Top 0.406: LED24.2 36.83,36.23 v36.83,34.29 | LED23.2 36.83,21 v36.83,19.05 | LED22.2 36.83,5.75 36.83,5.71 v36.83,3.81
  Bottom 0.406: v36.83,34.29 v36.83,19.05 v36.83,3.81
N$33  (via drill 0.5)
  Top 0.254: IC3.30 86.29,10.09 v85.73,9.53
  Bottom 0.254: X1.4 v85.73,9.53
N$34  (via drill 0.5)
  Top 0.254: C2.1 129.22,37.15 128.27,36.2 U1.14 123.83,36.2 122.56,37.46 120.65,37.46 v118.75,35.56
  Bottom 0.254: v118.75,35.56 118.75,12.7 118.11,12.06 118.11,8.26 119.38,6.98 BAT1.PWR@1
N$35  (via drill 0.5)
  Top 0.254: IC1.5 124.11,18.14 v121.92,20.32 | v121.92,31.75 121.29,31.12 97.79,31.12 93.98,34.92 v82.55,34.92 | IC3.15 83.09,23.59 v82.55,24.13
  Bottom 0.254: v121.92,31.75 v121.92,20.32 | v82.55,24.13 v82.55,34.92 82.55,36.83 83.19,37.46 83.19,40 JP1.4
N$36  (via drill 0.5, 0.6)
  Top 0.254: IC2.12 8.51,13.58 v8.26,13.33
  Top 0.406: v8.26,34.29 LED27.4 | v8.26,19.05 LED26.4 | v8.26,3.81 LED25.4
  Bottom 0.406: v8.26,34.29 v8.26,19.05 v8.26,13.33 v8.26,3.81
N$37  (via drill 0.5, 0.6)
  Top 0.254: IC2.13 10.39,12.94 v10.16,12.7
  Top 0.406: LED27.6 10.16,36.23 v10.16,34.29 | LED26.6 10.16,21 v10.16,19.05 | LED25.6 10.16,5.75 v10.16,3.81
  Bottom 0.406: v10.16,34.29 v10.16,19.05 v10.16,12.7 v10.16,3.81
N$38  (via drill 0.5, 0.6)
  Top 0.254: IC2.11 6.62,14.23 v6.35,13.97
  Top 0.406: LED27.2 6.35,36.23 v6.35,34.29 | LED26.2 6.35,21 v6.35,19.05 | LED25.2 6.35,5.75 v6.35,3.81
  Bottom 0.406: v6.35,34.29 v6.35,19.05 v6.35,13.97 v6.35,3.81
N$39  (via drill 0.5)
  Top 0.61: LED1.3 LED1.5 | LED1.3 175.89,10.79 | LED1.1 173.99,10.75 173.99,10.79 | LED1.1 LED1.3 | 162.56,10.75 LED4.5 LED4.3 | 162.56,10.75 LED1.1 | 162.56,10.75 162.56,10.79 | LED4.3 160.66,10.79 | LED4.1 158.75,10.75 158.75,10.79 | LED4.1 LED4.3 | 147.32,10.75 LED7.5 LED7.3 | 147.32,10.75 LED4.1 | 147.32,10.75 147.32,10.79 | LED7.3 145.41,10.79 | LED7.1 143.51,10.75 143.51,10.79 | LED7.1 LED7.3 | 116.84,10.75 LED10.5 LED10.3 | 116.84,10.75 116.84,10.79 | LED10.3 114.94,10.79 | LED10.1 113.03,10.75 113.03,10.79 | LED10.1 LED10.3 | 101.6,10.75 LED13.5 LED13.3 | 101.6,10.75 LED10.1 | 101.6,10.75 101.6,10.79 | LED13.3 99.7,10.79 | LED13.1 97.79,10.75 97.79,10.79 | LED13.1 LED13.3 | 71.12,10.75 LED16.5 LED16.3 | 71.12,10.75 71.12,10.79 | LED16.3 69.22,10.79 | LED16.1 67.31,10.75 67.31,10.79 | LED16.1 LED16.3 | 55.88,10.75 LED19.5 LED19.3 | 55.88,10.75 LED16.1 | 55.88,10.75 55.88,10.79 | LED19.3 53.98,10.79 | LED19.1 52.07,10.75 52.07,10.79 | LED19.1 LED19.3 | 40.64,10.75 LED22.5 LED22.3 | 40.64,10.75 LED19.1 | 40.64,10.75 40.64,10.79 | LED22.3 38.73,10.79 | LED22.1 36.83,10.75 36.83,10.79 | LED22.1 LED22.3 | 10.16,10.75 LED25.5 LED25.3 | 10.16,10.75 10.16,10.79 | LED25.3 8.26,10.79 | LED25.1 6.35,10.75 | 6.35,10.75 LED25.3 | 6.35,10.75 6.35,10.79 | 116.84,10.75 119.34,10.75 v119.38,10.79 | LED7.1 141.01,10.75 v140.97,10.79 | 10.16,10.75 11.39,10.75 v11.43,10.79 | LED22.1 34.33,10.75 v34.29,10.79 | 71.12,10.75 73.66,10.75 v73.66,10.79 | LED13.1 94.62,10.75 v94.62,10.79 | Q3.5 23.5,5.08 24.13,5.71 24.13,6.35 | 24.13,7.62 v24.13,8.89 Q3.8 | 24.13,7.62 24.13,6.35 | 24.13,7.62 Q3.7 | 24.13,6.35 Q3.6
  Bottom 0.61: v119.38,10.79 v140.97,10.79 | v11.43,10.79 24.13,10.79 | 24.13,10.79 v34.29,10.79 | v73.66,10.79 v94.62,10.79 | 24.13,10.79 v24.13,8.89
N$40  (via drill 0.5)
  Top 0.254: IC2.24 28.3,18.14 v30.48,20.32 | v30.48,27.31 31.75,28.58 73.66,28.58 74.93,27.31 v81.28,27.31 | IC3.16 82.29,23.12 v81.28,24.13
  Bottom 0.254: v30.48,20.32 v30.48,27.31 | v81.28,24.13 v81.28,27.31 81.28,38.1 JP1.1
N$41  (via drill 0.5)
  Top 0.254: IC3.28 84.69,8.65 85.09,8.26 92.08,8.26 92.71,8.89 106.68,8.89 107.32,9.53 v109.86,9.53 | 125.73,33.66 U1.16 v122.56,33.66
  Bottom 0.254: v109.86,9.53 109.22,10.16 109.22,36.2 110.49,37.46 118.75,37.46 v122.56,33.66
N$42  (via drill 0.5)
  Top 0.254: U1.15 123.19,34.92 v122.56,35.56 | v107.95,8.26 93.34,8.26 92.71,7.62 84.45,7.62 83.89,8.19 IC3.27
  Bottom 0.254: v122.56,35.56 120.02,38.1 109.86,38.1 108.59,36.83 108.59,8.89 v107.95,8.26
N$43
  Top 0.254: C3.1 78.11,15.24 78.51,15.64 IC3.20
N$44  (via drill 0.5)
  Top 0.254: IC3.31 87.09,10.06 v87.63,9.53
  Bottom 0.254: v87.63,9.53 88.27,8.89 X1.5
N$45
  Top 0.254: R4.2 13.97,5.71 14.61,5.08 Q3.4
N$46  (via drill 0.5)
  Top 0.254: R3.2 22.86,33.66 23.5,34.29 v23.5,41.27 | v23.5,45.09 25.08,45.09 25.4,44.77 Q2.4
  Bottom 0.254: v23.5,41.27 v23.5,45.09
N$47
  Top 0.254: R2.2 21.59,37.15 Q1.4
N$48
  Top 0.254: IC1.27 134.38,20.09 137.79,23.5 R6.2
N$49
  Top 0.254: IC2.27 27.71,20.09 30.48,22.86 R5.2
N$50
  Top 0.254: X1.6 90.81,5.08 88.59,2.86 C8.2
N$51  (via drill 0.5)
  Top 0.254: IC3.23 81.5,13.24 82.23,13.97 v82.23,15.88 | v12.7,36.2 R2.1
  Bottom 0.254: v82.23,15.88 78.11,15.88 73.66,20.32 73.66,38.1 72.39,39.37 15.88,39.37 v12.7,36.2
N$52  (via drill 0.5)
  Top 0.254: v13.97,33.66 R3.1 | IC3.24 80.8,11.9 80.01,11.11 76.2,11.11 v74.93,12.38
  Bottom 0.254: v13.97,33.66 13.97,35.56 16.51,38.1 72.39,38.1 73.03,37.46 73.03,14.29 v74.93,12.38
N$53  (via drill 0.5)
  Top 0.254: IC3.25 82.29,9.9 v81.92,9.53 | v13.97,9.53 R4.1
  Bottom 0.254: v81.92,9.53 74.93,9.53 73.66,8.26 73.66,3.17 72.39,1.91 36.2,1.91 34.92,3.17 15.88,3.17 13.97,5.08 v13.97,9.53
RESET  (via drill 0.5)
  Top 0.254: IC3.29 85.49,13.1 v85.73,13.33 83.19,13.33 80.65,10.79 80.65,8.26 81.92,6.98 81.92,3.17 83.19,1.91 C8.1 | R1.1 90.17,39.37 89.54,38.73 JP1.5
  Bottom 0.254: v85.73,13.33 86.36,13.97 86.36,38.1 JP1.5